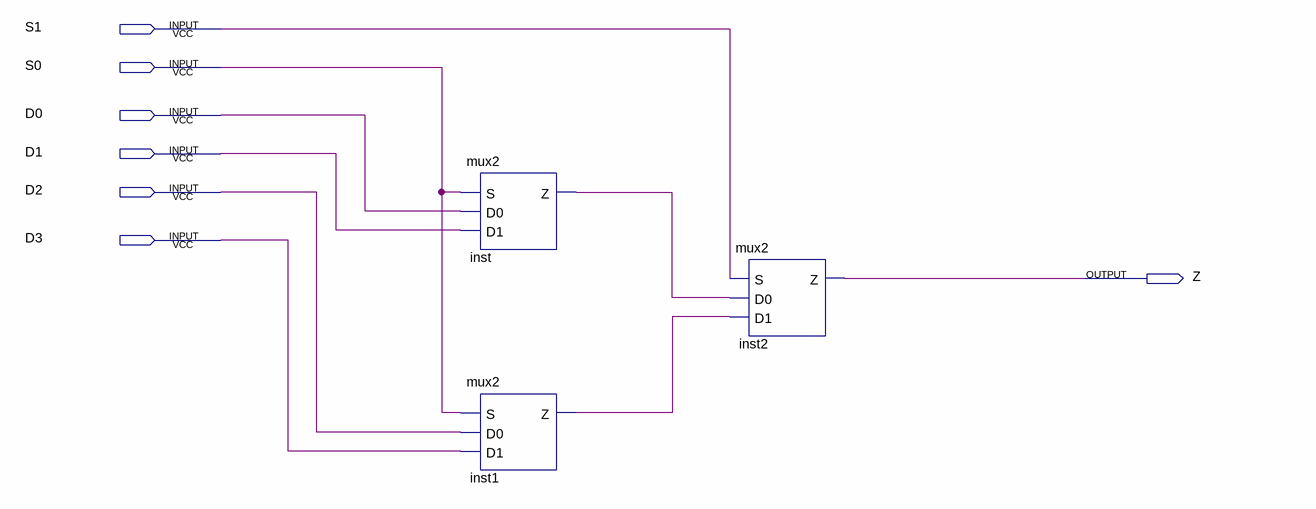
[diagram p0: schematic sheet]
// Quartus schematic mux4.bdf as structural Verilog: 3 symbols, 7 pins
module mux4 (
  input  S1,
  input  S0,
  input  D0,
  input  D1,
  input  D2,
  input  D3,
  output Z
);

  wire inst1_z, inst_z;

  mux2 inst (.S(S0), .D0(D0), .D1(D1), .Z(inst_z));
  mux2 inst1 (.S(S0), .D0(D2), .D1(D3), .Z(inst1_z));
  mux2 inst2 (.S(S1), .D0(inst_z), .D1(inst1_z), .Z(Z));
endmodule
